# Altium schematic sheet Sheet_1.schdoc
size 158 x 110 mm
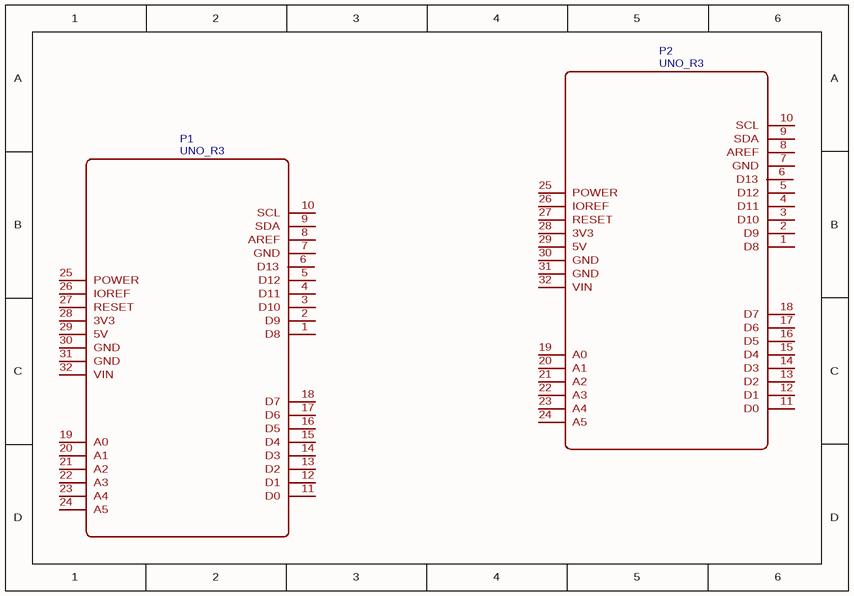
[diagram p0: Sheet_1.schdoc]

## Parts
P1  UNO_R3  [UNO_R3]
P2  UNO_R3  [UNO_R3]

## Nets

Not connected (* = marked no-connect by the designer): P1 1(D8) 2(D9) 3(D10) 4(D11) 5(D12) 6(D13) 7(GND) 8(AREF) 9(SDA) 10(SCL) 11(D0) 12(D1) 13(D2) 14(D3) 15(D4) 16(D5) 17(D6) 18(D7) 19(A0) 20(A1) 21(A2) 22(A3) 23(A4) 24(A5) 25(POWER) 26(IOREF) 27(RESET) 28(3V3) 29(5V) 30(GND) 31(GND) 32(VIN); P2 1(D8) 2(D9) 3(D10) 4(D11) 5(D12) 6(D13) 7(GND) 8(AREF) 9(SDA) 10(SCL) 11(D0) 12(D1) 13(D2) 14(D3) 15(D4) 16(D5) 17(D6) 18(D7) 19(A0) 20(A1) 21(A2) 22(A3) 23(A4) 24(A5) 25(POWER) 26(IOREF) 27(RESET) 28(3V3) 29(5V) 30(GND) 31(GND) 32(VIN)

## Library data of the parts
P1 P2 = UNO_R3: sourceId: 1T5FDZYC8; timeStamp: 1460354705; BOM_Manufacturer Part: ?; spicePre: P